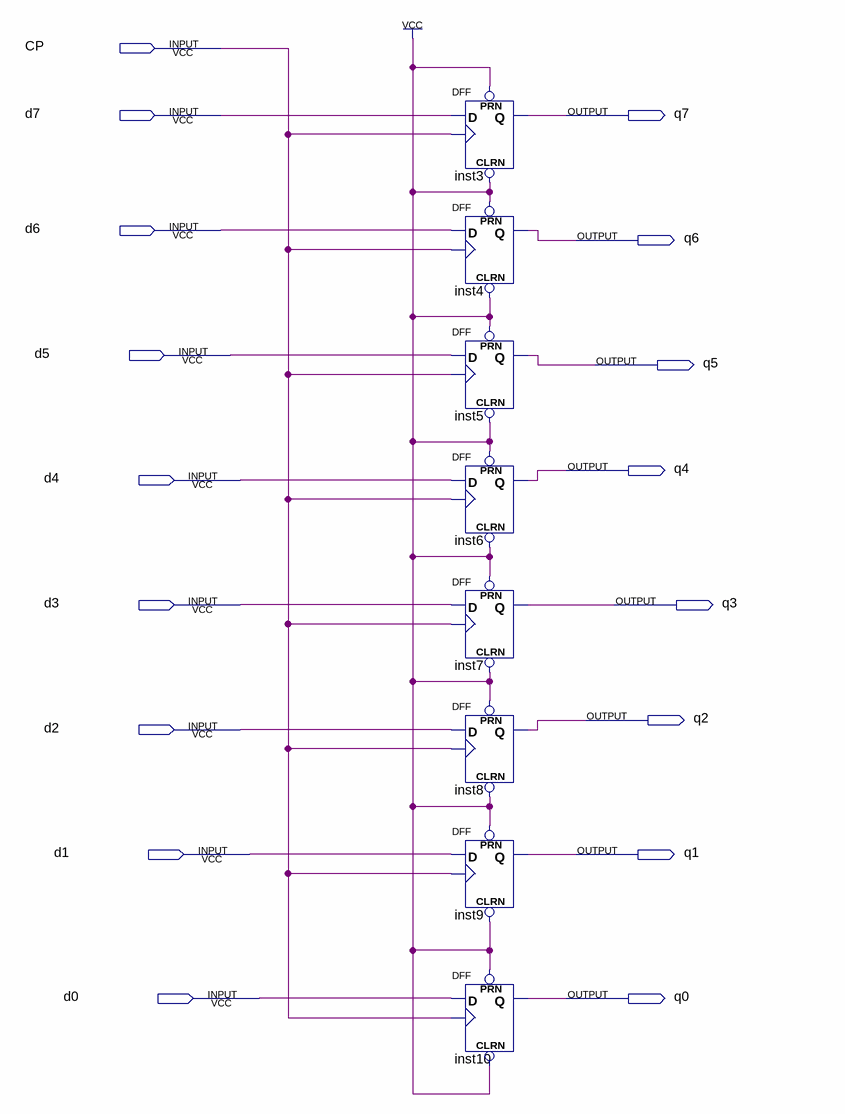
[diagram p0: schematic sheet]
// Quartus schematic lb51.bdf as structural Verilog: 8 symbols, 17 pins
module lb51 (
  input  CP,
  input  d7,
  input  d6,
  input  d5,
  input  d4,
  input  d3,
  input  d2,
  input  d1,
  input  d0,
  output q7,
  output q6,
  output q5,
  output q4,
  output q3,
  output q2,
  output q1,
  output q0
);

  DFF inst3 (.CLRN(1'b1), .CLK(CP), .D(d7), .PRN(1'b1), .Q(q7));
  DFF inst4 (.CLRN(1'b1), .CLK(CP), .D(d6), .PRN(1'b1), .Q(q6));
  DFF inst5 (.CLRN(1'b1), .CLK(CP), .D(d5), .PRN(1'b1), .Q(q5));
  DFF inst6 (.CLRN(1'b1), .CLK(CP), .D(d4), .PRN(1'b1), .Q(q4));
  DFF inst7 (.CLRN(1'b1), .CLK(CP), .D(d3), .PRN(1'b1), .Q(q3));
  DFF inst8 (.CLRN(1'b1), .CLK(CP), .D(d2), .PRN(1'b1), .Q(q2));
  DFF inst9 (.CLRN(1'b1), .CLK(CP), .D(d1), .PRN(1'b1), .Q(q1));
  DFF inst10 (.CLRN(1'b1), .CLK(CP), .D(d0), .PRN(1'b1), .Q(q0));
endmodule
